# Altium schematic sheet Sheet1.SchDoc: RN2483 Radio
size A; Date: 2022-02-22; CompanyName: CUInSpace; DrawnBy: Matteo Golin; Engineer: Matteo Golin; Organization: CUInSpace; Revision: B; SheetNumber: 1; SheetTotal: 2
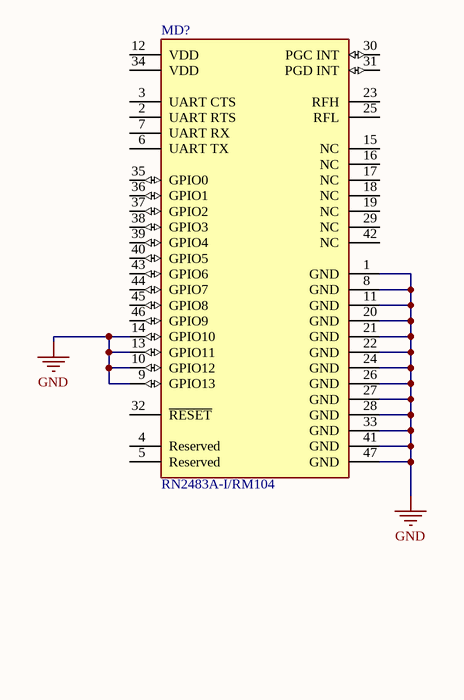
[diagram p0: Sheet1.SchDoc]

## Parts
MD?  RN2483A-I/RM104  [FP-RN2483A-I-RM104-MFG]

## Nets
GND: MD?.1(GND) MD?.8(GND) MD?.9(GPIO13) MD?.10(GPIO12) MD?.11(GND) MD?.13(GPIO11) MD?.14(GPIO10) MD?.20(GND) MD?.21(GND) MD?.22(GND) MD?.24(GND) MD?.26(GND) MD?.27(GND) MD?.28(GND) MD?.33(GND) MD?.41(GND) MD?.47(GND)

Not connected (* = marked no-connect by the designer): MD? 2(UART_RTS) 3(UART_CTS) 4(Reserved) 5(Reserved) 6(UART_TX) 7(UART_RX) 12(VDD) 15(NC) 16(NC) 17(NC) 18(NC) 19(NC) 23(RFH) 25(RFL) 29(NC) 30(PGC_INT) 31(PGD_INT) 32(~{RESET}) 34(VDD) 35(GPIO0) 36(GPIO1) 37(GPIO2) 38(GPIO3) 39(GPIO4) 40(GPIO5) 42(NC) 43(GPIO6) 44(GPIO7) 45(GPIO8) 46(GPIO9)

## Notes on the sheet
- Type @ to refer to a designator or a net

## Library data of the parts
MD? = CMP-06331-000004-1: Manufacturer: Microchip; Sensitivity: -146dBm; Transmitting Current: 44.5mA; Interface: I2C,SPI,UART; Max Frequency: 870MHz; Number Of Adc Channels: 13; Number Of Gpio: 14; Min Supply Voltage: 2.1V; Data Rate: 300kbits/s; Max Supply Voltage: 3.6V; Bandwidth: 1.74MHz; Mouser Description: RF Transceiver Module FSK/GFSK/LoRa 434.79MHz/870MHz 3.3V SMD Tray; Temperature Range Low: -40°C; ComponentLink2URL: http://ww1.microchip.com/downloads/en/DeviceDoc/RN2483-Low-Power-Long-Range-LoRa-Technology-Transceiver-Module-Data-Sheet-DS50002346D.pdf; Manufacturer Part Number: RN2483A-I/RM104; Octopart: https://octopart.com/rn2483a-i%2Frm104-microchip-90584481; Package: RN2483A-I/RM104; Digikey Description: RN2483A-I/RM104; Category: UNK; Temperature Range High: +85°C; Device Class L3: Transceivers; Lead Free: Yes; Description: RN2483A-I/RM104; Height: 3.467mm; Temperature: -40°C to +85°C; RoHS: TRUE; Automotive: No; ComponentLink2Description: Datasheet; Device Class L1: Integrated Circuits (ICs); Device Class L2: RF Semiconductors and Devices